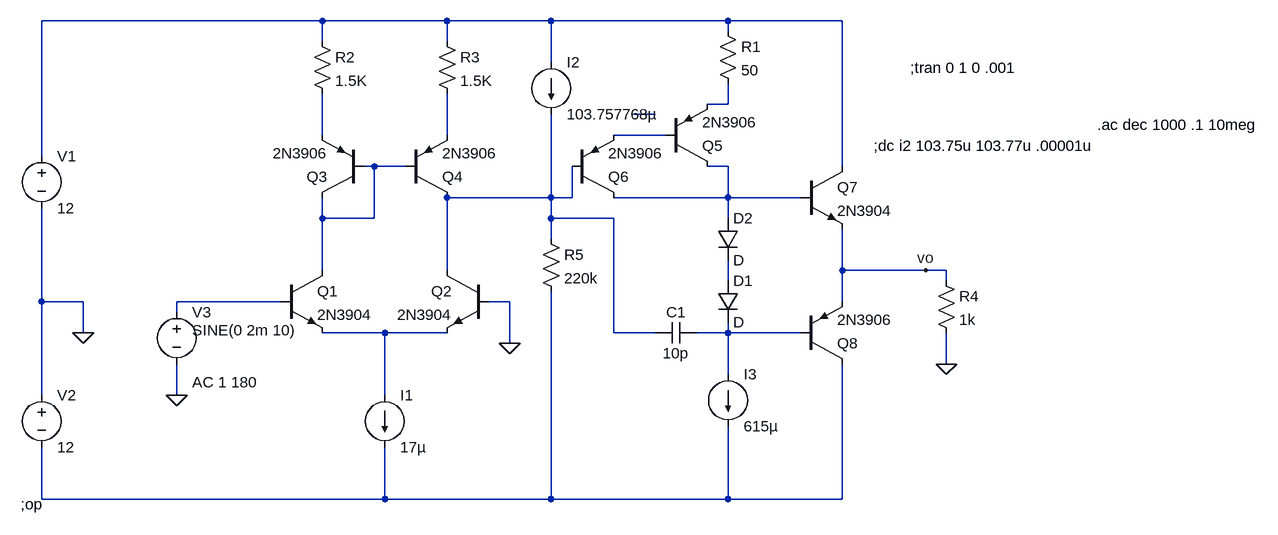
[diagram p0: schematic op_gen3.asc]
op_gen3.asc, the LTspice schematic file:
Version 4
SHEET 1 1588 680
WIRE 112 -256 -320 -256
WIRE 304 -256 112 -256
WIRE 464 -256 304 -256
WIRE 736 -256 464 -256
WIRE 912 -256 736 -256
WIRE 736 -240 736 -256
WIRE 112 -224 112 -256
WIRE 304 -224 304 -256
WIRE 464 -192 464 -256
WIRE 736 -128 736 -160
WIRE 736 -128 704 -128
WIRE 112 -112 112 -144
WIRE 304 -112 304 -144
WIRE 624 -112 592 -112
WIRE 112 -80 112 -112
WIRE 304 -80 304 -112
WIRE 640 -80 560 -80
WIRE -320 -48 -320 -256
WIRE 192 -32 176 -32
WIRE 240 -32 192 -32
WIRE 464 -32 464 -112
WIRE 736 -32 704 -32
WIRE 912 -32 912 -256
WIRE 464 16 464 -32
WIRE 464 16 304 16
WIRE 496 16 496 -32
WIRE 496 16 464 16
WIRE 736 16 736 -32
WIRE 736 16 560 16
WIRE 848 16 736 16
WIRE 112 48 112 16
WIRE 192 48 192 -32
WIRE 192 48 112 48
WIRE 304 48 304 16
WIRE 464 48 464 16
WIRE 560 48 464 48
WIRE 736 48 736 16
WIRE 112 64 112 48
WIRE 464 80 464 48
WIRE 112 128 112 64
WIRE 304 128 304 48
WIRE 912 128 912 64
WIRE 944 128 912 128
WIRE 1040 128 944 128
WIRE 1072 128 1040 128
WIRE 736 144 736 112
WIRE 1072 144 1072 128
WIRE -320 176 -320 32
WIRE -256 176 -320 176
WIRE 48 176 -112 176
WIRE 400 176 368 176
WIRE 912 176 912 128
WIRE -112 192 -112 176
WIRE -256 224 -256 176
WIRE 208 224 112 224
WIRE 304 224 208 224
WIRE 560 224 560 48
WIRE 624 224 560 224
WIRE 736 224 736 208
WIRE 736 224 688 224
WIRE 800 224 736 224
WIRE 848 224 800 224
WIRE 400 240 400 176
WIRE 1072 272 1072 224
WIRE 736 288 736 224
WIRE -320 320 -320 176
WIRE -112 320 -112 272
WIRE 208 320 208 224
WIRE -320 480 -320 400
WIRE 208 480 208 400
WIRE 208 480 -320 480
WIRE 464 480 464 160
WIRE 464 480 208 480
WIRE 736 480 736 368
WIRE 736 480 464 480
WIRE 912 480 912 272
WIRE 912 480 736 480
FLAG 400 240 0
FLAG -112 320 0
FLAG -256 224 0
FLAG 1072 272 0
FLAG 1040 128 vo
DATAFLAG 208 224 ""
DATAFLAG 304 48 ""
DATAFLAG 112 64 ""
DATAFLAG 944 128 ""
DATAFLAG 800 224 ""
DATAFLAG 448 224 ""
DATAFLAG 464 -32 ""
DATAFLAG 304 -112 ""
DATAFLAG 112 -112 ""
SYMBOL npn 48 128 R0
SYMATTR InstName Q1
SYMATTR Value 2N3904
SYMBOL npn 368 128 M0
SYMATTR InstName Q2
SYMATTR Value 2N3904
SYMBOL pnp 176 16 R180
SYMATTR InstName Q3
SYMATTR Value 2N3906
SYMBOL pnp 240 16 M180
SYMATTR InstName Q4
SYMATTR Value 2N3906
SYMBOL current 208 320 R0
WINDOW 123 0 0 Left 2
WINDOW 39 0 0 Left 2
SYMATTR InstName I1
SYMATTR Value 17µ
SYMBOL diode 720 144 R0
SYMATTR InstName D1
SYMBOL diode 720 48 R0
SYMATTR InstName D2
SYMBOL current 736 288 R0
WINDOW 123 0 0 Left 2
WINDOW 39 0 0 Left 2
SYMATTR InstName I3
SYMATTR Value 615µ
SYMBOL npn 848 -32 R0
SYMATTR InstName Q7
SYMATTR Value 2N3904
SYMBOL pnp 848 272 M180
SYMATTR InstName Q8
SYMATTR Value 2N3906
SYMBOL voltage -320 -64 R0
WINDOW 123 0 0 Left 2
WINDOW 39 0 0 Left 2
SYMATTR InstName V1
SYMATTR Value 12
SYMBOL voltage -320 304 R0
WINDOW 123 0 0 Left 2
WINDOW 39 0 0 Left 2
SYMATTR InstName V2
SYMATTR Value 12
SYMBOL res 96 -240 R0
SYMATTR InstName R2
SYMATTR Value 1.5K
SYMBOL res 288 -240 R0
SYMATTR InstName R3
SYMATTR Value 1.5K
SYMBOL res 1056 128 R0
SYMATTR InstName R4
SYMATTR Value 1k
SYMBOL voltage -112 176 R0
WINDOW 123 24 124 Left 2
WINDOW 39 0 0 Left 2
WINDOW 3 24 44 Left 2
SYMATTR Value2 AC 1 180
SYMATTR Value SINE(0 2m 10)
SYMATTR InstName V3
SYMBOL pnp 640 -32 M180
SYMATTR InstName Q5
SYMATTR Value 2N3906
SYMBOL res 720 -256 R0
SYMATTR InstName R1
SYMATTR Value 50
SYMBOL current 464 -192 R0
WINDOW 123 0 0 Left 2
WINDOW 39 0 0 Left 2
SYMATTR InstName I2
SYMATTR Value 103.757768µ
SYMBOL pnp 496 16 M180
SYMATTR InstName Q6
SYMATTR Value 2N3906
SYMBOL res 448 64 R0
SYMATTR InstName R5
SYMATTR Value 220k
SYMBOL cap 688 208 R90
WINDOW 0 0 32 VBottom 2
WINDOW 3 32 32 VTop 2
SYMATTR InstName C1
SYMATTR Value 10p
TEXT -352 488 Left 2 !;op
TEXT 960 -64 Left 2 !;dc i2 103.75u 103.77u .00001u
TEXT 1304 -96 Left 2 !.ac dec 1000 .1 10meg
TEXT 1016 -184 Left 2 !;tran 0 1 0 .001

The netlist it stands for:
* op_gen3.asc
Q1 N007 N011 N012 0 2N3904
Q2 N008 0 N012 0 2N3904
Q3 N007 N007 N003 0 2N3906
Q4 N008 N007 N004 0 2N3906
I1 N012 N014 17µ
D1 N010 N013 D
D2 N009 N010 D
I3 N013 N014 615µ
Q7 N001 N009 vo 0 2N3904
Q8 N014 N013 vo 0 2N3906
V1 N001 0 12
V2 0 N014 12
R2 N001 N003 1.5K
R3 N001 N004 1.5K
R4 vo 0 1k
V3 N011 0 SINE(0 2m 10) AC 1 180
Q5 N009 N006 N002 0 2N3906
R1 N001 N002 50
I2 N001 N008 103.757768µ
Q6 N009 N008 N006 0 2N3906
R5 N008 N014 220k
C1 N013 N008 10p
.model D D
.lib standard.dio
.model NPN NPN
.model PNP PNP
.lib standard.bjt
;op
;dc i2 103.75u 103.77u .00001u
.ac dec 1000 .1 10meg
;tran 0 1 0 .001
.backanno
.end